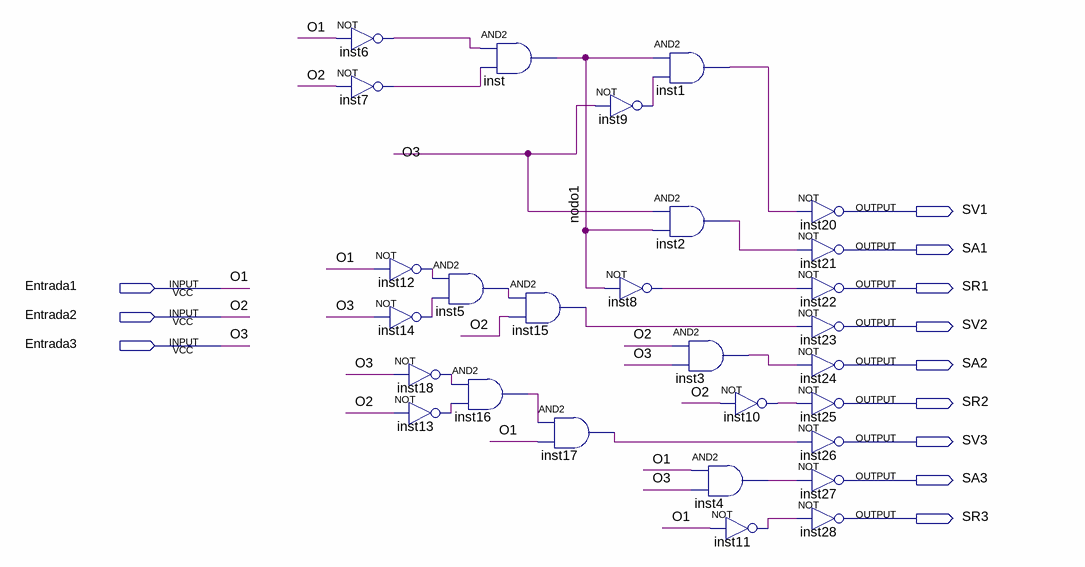
[diagram p0: schematic sheet]
// Quartus schematic Decodificador.bdf as structural Verilog: 28 symbols, 12 pins
module Decodificador (
  input  Entrada1,
  input  Entrada2,
  input  Entrada3,
  output SV1,
  output SA1,
  output SR1,
  output SV2,
  output SA2,
  output SR2,
  output SV3,
  output SA3,
  output SR3
);

  wire inst1_out, inst2_out, inst3_out, inst4_out, inst5_out, inst6_out, inst7_out, inst8_out, inst9_out,
       inst10_out, inst11_out, inst12_out, inst13_out, inst14_out, inst15_out, inst16_out, inst17_out,
       inst18_out, nodo1;

  not inst6 (inst6_out, Entrada1);
  not inst7 (inst7_out, Entrada2);
  not inst12 (inst12_out, Entrada1);
  not inst14 (inst14_out, Entrada3);
  and inst5 (inst5_out, inst12_out, inst14_out);
  not inst18 (inst18_out, Entrada3);
  and inst16 (inst16_out, inst18_out, inst13_out);
  not inst13 (inst13_out, Entrada2);
  and inst (nodo1, inst6_out, inst7_out);
  and inst15 (inst15_out, inst5_out, Entrada2);
  and inst17 (inst17_out, inst16_out, Entrada1);
  not inst9 (inst9_out, Entrada3);
  not inst8 (inst8_out, nodo1);
  and inst1 (inst1_out, nodo1, inst9_out);
  and inst2 (inst2_out, Entrada3, nodo1);
  and inst3 (inst3_out, Entrada2, Entrada3);
  and inst4 (inst4_out, Entrada1, Entrada3);
  not inst10 (inst10_out, Entrada2);
  not inst11 (inst11_out, Entrada1);
  not inst20 (SV1, inst1_out);
  not inst21 (SA1, inst2_out);
  not inst22 (SR1, inst8_out);
  not inst23 (SV2, inst15_out);
  not inst24 (SA2, inst3_out);
  not inst25 (SR2, inst10_out);
  not inst26 (SV3, inst17_out);
  not inst27 (SA3, inst4_out);
  not inst28 (SR3, inst11_out);

  // Other names for the same wires on the sheet: O1 = Entrada1; O2 = Entrada2; O3 = Entrada3
endmodule
